# Altium schematic sheet TMS320F28379D_Interfaz.SchDoc
size Legal
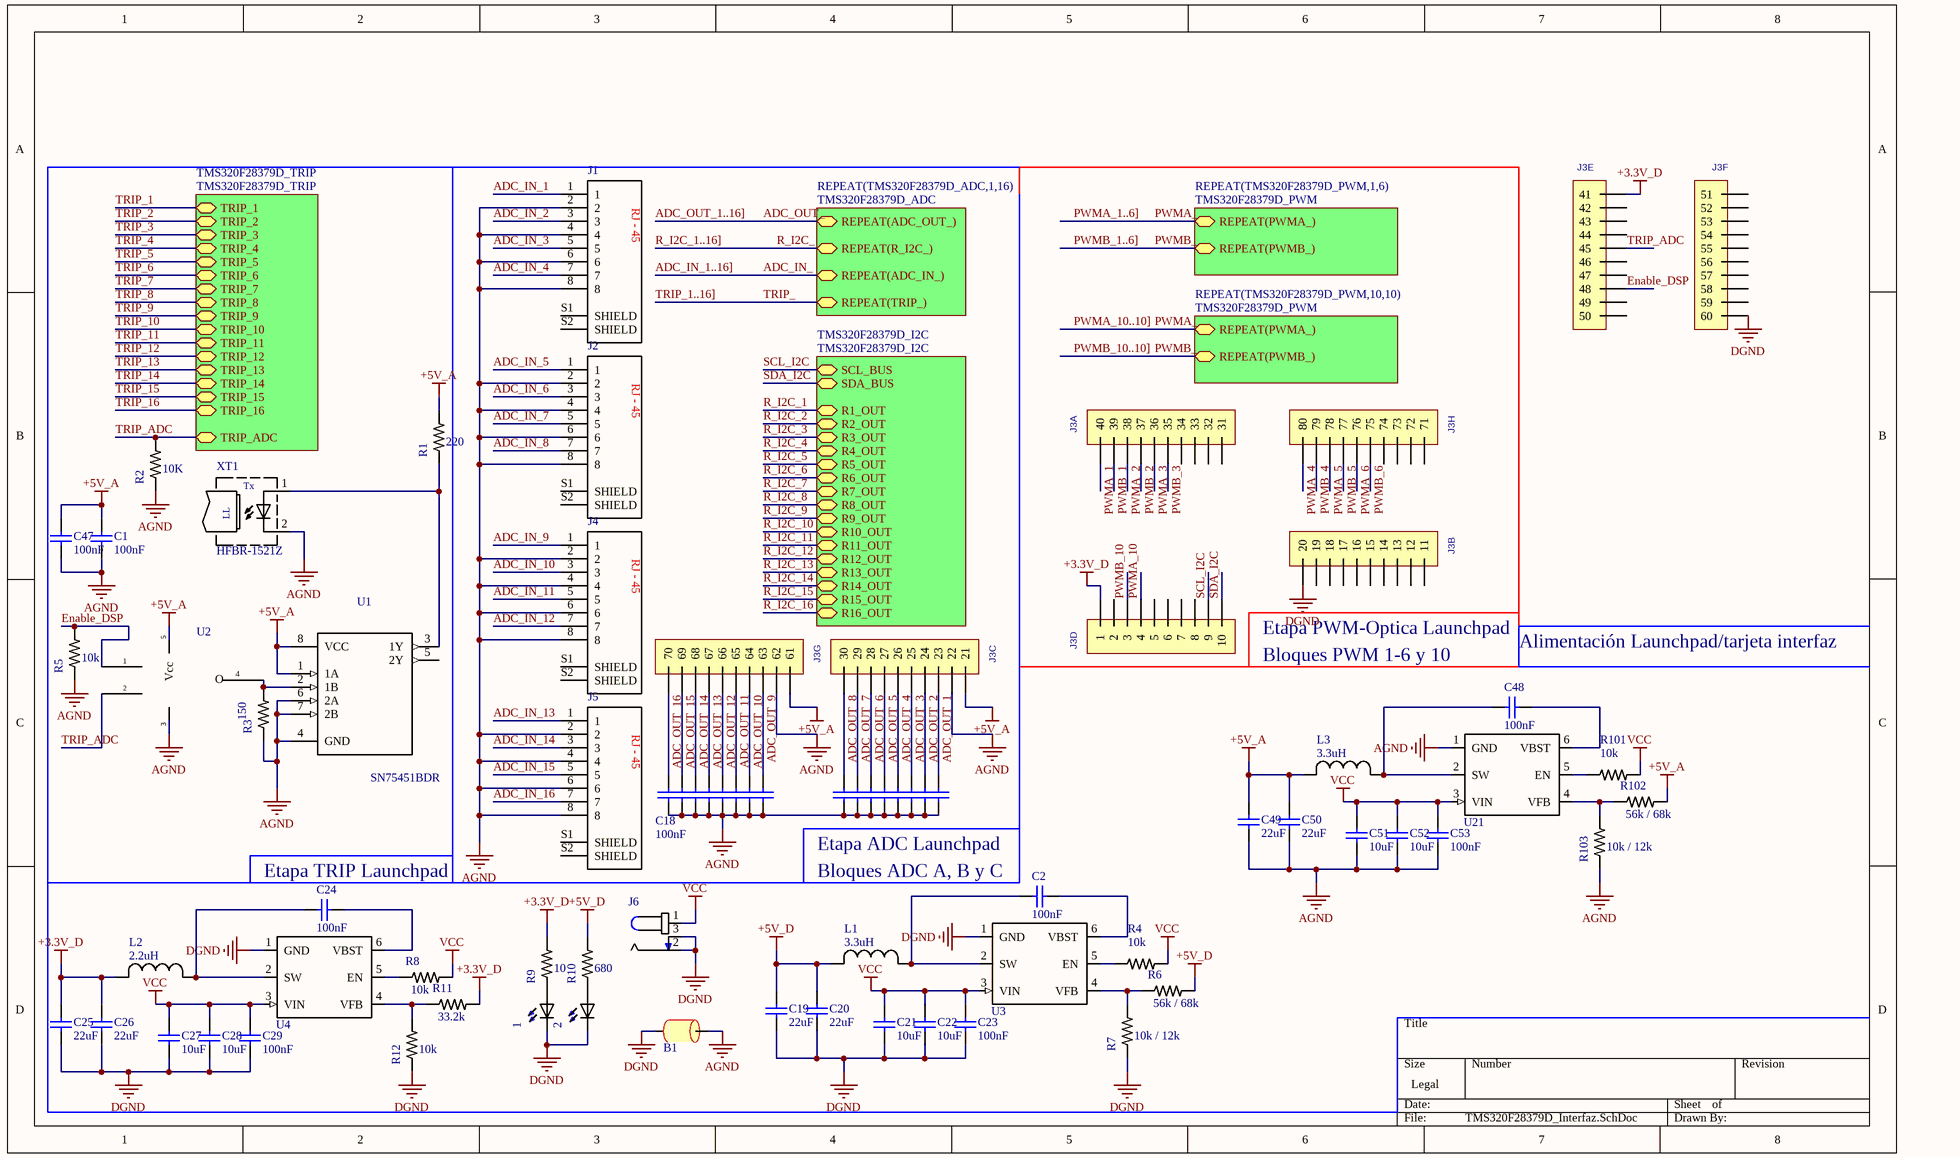
[diagram p0: TMS320F28379D_Interfaz.SchDoc]

## Parts
1  LED  [LED_0805]  (value not drawn)
2  LED  [LED_0805]  (value not drawn)
B1  Bead  [1206]  (value not drawn)
C1  value 100nF  [CAP 0805]  (hidden comment: Cap cerámico)
C2  value 100nF  [CAP 0805]  (hidden comment: Cap cerámico)
C3  Cap cerámico  [CAP 0805]  (value not drawn)
C4  Cap cerámico  [CAP 0805]  (value not drawn)
C5  Cap cerámico  [CAP 0805]  (value not drawn)
C6  Cap cerámico  [CAP 0805]  (value not drawn)
C7  Cap cerámico  [CAP 0805]  (value not drawn)
C8  Cap cerámico  [CAP 0805]  (value not drawn)
C9  Cap cerámico  [CAP 0805]  (value not drawn)
C10  Cap cerámico  [CAP 0805]  (value not drawn)
C11  Cap cerámico  [CAP 0805]  (value not drawn)
C12  Cap cerámico  [CAP 0805]  (value not drawn)
C13  Cap cerámico  [CAP 0805]  (value not drawn)
C14  Cap cerámico  [CAP 0805]  (value not drawn)
C15  Cap cerámico  [CAP 0805]  (value not drawn)
C16  Cap cerámico  [CAP 0805]  (value not drawn)
C17  Cap cerámico  [CAP 0805]  (value not drawn)
C18  value 100nF  [CAP 0805]  (hidden comment: Cap cerámico)
C19  value 22uF  [CAP 1206]  (hidden comment: Cap cerámico)
C20  value 22uF  [CAP 1206]  (hidden comment: Cap cerámico)
C21  value 10uF  [CAP 1206]  (hidden comment: Cap cerámico)
C22  value 10uF  [CAP 1206]  (hidden comment: Cap cerámico)
C23  value 100nF  [CAP 0805]  (hidden comment: Cap cerámico)
C24  value 100nF  [CAP 0805]  (hidden comment: Cap cerámico)
C25  value 22uF  [CAP 1206]  (hidden comment: Cap cerámico)
C26  value 22uF  [CAP 1206]  (hidden comment: Cap cerámico)
C27  value 10uF  [CAP 1206]  (hidden comment: Cap cerámico)
C28  value 10uF  [CAP 1206]  (hidden comment: Cap cerámico)
C29  value 100nF  [CAP 0805]  (hidden comment: Cap cerámico)
C47  value 100nF  [CAP 0805]  (hidden comment: Cap cerámico)
C48  value 100nF  [CAP 0805]  (hidden comment: Cap cerámico)
C49  value 22uF  [CAP 1206]  (hidden comment: Cap cerámico)
C50  value 22uF  [CAP 1206]  (hidden comment: Cap cerámico)
C51  value 10uF  [CAP 1206]  (hidden comment: Cap cerámico)
C52  value 10uF  [CAP 1206]  (hidden comment: Cap cerámico)
C53  value 100nF  [CAP 0805]  (hidden comment: Cap cerámico)
J1  Ethernet TH  [ETHERNET TH]  (value not drawn)
J2  Ethernet TH  [ETHERNET TH]  (value not drawn)
J3  Header 20pin  [Header 20pin_TMS320F28379D]  (value not drawn)  (parts A,B,C,D,E,F,G,H of 8)
J4  Ethernet TH  [ETHERNET TH]  (value not drawn)
J5  Ethernet TH  [ETHERNET TH]  (value not drawn)
J6  694106301002  [Power Jack DC]  (value not drawn)
L1  value 3.3uH  [Inductor 3.3uH]  (hidden comment: Inductor 3.3uH)
L2  value 2.2uH  [Inductor 3.3uH]  (hidden comment: Inductor 2.2uH)
L3  value 3.3uH  [Inductor 3.3uH]  (hidden comment: Inductor 3.3uH)
R1  value 220  [Resistor 0805]  (hidden comment: Resistor 0805)
R2  value 10K  [Resistor 0805]  (hidden comment: Resistor 0805)
R3  value 150  [Resistor 0805]  (hidden comment: Resistor 0805)
R4  value 10k  [Resistor 0805]  (hidden comment: Resistor 0805)
R5  value 10k  [Resistor 0805]  (hidden comment: Resistor 0805)
R6  value 56k / 68k  [Resistor 0805]  (hidden comment: Resistor 0805)
R7  value 10k / 12k  [Resistor 0805]  (hidden comment: Resistor 0805)
R8  value 10k  [Resistor 0805]  (hidden comment: Resistor 0805)
R9  value 10  [Resistor 0805]  (hidden comment: Resistor 0805)
R10  value 680  [Resistor 0805]  (hidden comment: Resistor 0805)
R11  value 33.2k  [Resistor 0805]  (hidden comment: Resistor 0805)
R12  value 10k  [Resistor 0805]  (hidden comment: Resistor 0805)
R101  value 10k  [Resistor 0805]  (hidden comment: Resistor 0805)
R102  value 56k / 68k  [Resistor 0805]  (hidden comment: Resistor 0805)
R103  value 10k / 12k  [Resistor 0805]  (hidden comment: Resistor 0805)
U1  SN75451BDR  [8-SOIC]
U2  NOR MC74VHC1G02DFT2G  [SOT-553]  (value not drawn)
U3  TPS565201DDCR  [6-SOT-23]  (value not drawn)
U4  TPS565201DDCR  [6-SOT-23]  (value not drawn)
U21  TPS565201DDCR  [6-SOT-23]  (value not drawn)
XT1  HFBR-1521Z  [HFBR-15X1Z]

## Sub-sheets
REPEAT(TMS320F28379D_ADC,1,16) = TMS320F28379D_ADC: REPEAT(ADC_OUT_), REPEAT(R_I2C_), REPEAT(ADC_IN_), REPEAT(TRIP_)
REPEAT(TMS320F28379D_PWM,1,6) = TMS320F28379D_PWM: REPEAT(PWMA_), REPEAT(PWMB_)
REPEAT(TMS320F28379D_PWM,10,10) = TMS320F28379D_PWM: REPEAT(PWMA_), REPEAT(PWMB_)
TMS320F28379D_I2C = TMS320F28379D_I2C: SCL_BUS, SDA_BUS, R1_OUT, R2_OUT, R3_OUT, R4_OUT, R5_OUT, R6_OUT, R7_OUT, R8_OUT, R9_OUT, R10_OUT, R11_OUT, R12_OUT, R13_OUT, R14_OUT, R15_OUT, R16_OUT
TMS320F28379D_TRIP = TMS320F28379D_TRIP: TRIP_1, TRIP_2, TRIP_3, TRIP_4, TRIP_5, TRIP_6, TRIP_7, TRIP_8, TRIP_9, TRIP_10, TRIP_11, TRIP_12, TRIP_13, TRIP_14, TRIP_15, TRIP_16, TRIP_ADC

## Nets
+3.3V_D: C25.2 C26.2 J3.1 J3.41 L2.2 R9.2 R11.2
+5V_A: C1.2 C47.2 C49.2 C50.2 J3.21 J3.61 L3.2 R1.2 R102.2 U1.1(1A) U1.8(VCC) U2.5(Vcc)
+5V_D: C19.2 C20.2 L1.2 R6.2 R10.2
AGND: B1.1 C1.1 C3.2 C4.2 C5.2 C6.2 C7.2 C8.2 C9.2 C10.2 C11.2 C12.2 C13.2 C14.2 C15.2 C16.2 C17.2 C18.1 C47.1 C49.1 C50.1 C51.2 C52.2 C53.2 J1.2 J1.4 J1.6 J1.8 J2.2 J2.4 J2.6 J2.8 J3.22 J3.62 J4.2 J4.4 J4.6 J4.8 J5.2 J5.4 J5.6 J5.8 R2.1 R3.1 R5.1 R103.1 U1.4(GND) U1.6(2A) U1.7(2B) U2.3(GND) U21.1(GND) XT1.2(C)
DGND: 1.1(NEG) 2.1(NEG) B1.2 C19.1 C20.1 C21.2 C22.2 C23.2 C25.1 C26.1 C27.2 C28.2 C29.2 J3.20 J3.60 J6.2 J6.3 R7.1 R12.1 U3.1(GND) U4.1(GND)
VCC: C21.1 C22.1 C23.1 C27.1 C28.1 C29.1 C51.1 C52.1 C53.1 J6.1 R4.2 R8.2 R101.2 U3.3(VIN) U4.3(VIN) U21.3(VIN)
ADC_IN_: sheet REPEAT(TMS320F28379D_ADC,1,16)/REPEAT(ADC_IN_)
ADC_IN_1: J1.1
ADC_IN_2: J1.3
ADC_IN_3: J1.5
ADC_IN_4: J1.7
ADC_IN_5: J2.1
ADC_IN_6: J2.3
ADC_IN_7: J2.5
ADC_IN_8: J2.7
ADC_IN_9: J4.1
ADC_IN_10: J4.3
ADC_IN_11: J4.5
ADC_IN_12: J4.7
ADC_IN_13: J5.1
ADC_IN_14: J5.3
ADC_IN_15: J5.5
ADC_IN_16: J5.7
ADC_OUT_: sheet REPEAT(TMS320F28379D_ADC,1,16)/REPEAT(ADC_OUT_)
ADC_OUT_1: C17.1 J3.23
ADC_OUT_2: C16.1 J3.24
ADC_OUT_3: C15.1 J3.25
ADC_OUT_4: C14.1 J3.26
ADC_OUT_5: C13.1 J3.27
ADC_OUT_6: C12.1 J3.28
ADC_OUT_7: C11.1 J3.29
ADC_OUT_8: C10.1 J3.30
ADC_OUT_9: C9.1 J3.63
ADC_OUT_10: C8.1 J3.64
ADC_OUT_11: C7.1 J3.65
ADC_OUT_12: C6.1 J3.66
ADC_OUT_13: C5.1 J3.67
ADC_OUT_14: C4.1 J3.68
ADC_OUT_15: C3.1 J3.69
ADC_OUT_16: C18.2 J3.70
Enable_DSP: J3.48 R5.2 U2.1
PWMA_: sheet REPEAT(TMS320F28379D_PWM,1,6)/REPEAT(PWMA_), sheet REPEAT(TMS320F28379D_PWM,10,10)/REPEAT(PWMA_)
PWMA_1: J3.40
PWMA_2: J3.38
PWMA_3: J3.36
PWMA_4: J3.80
PWMA_5: J3.78
PWMA_6: J3.76
PWMA_10: J3.4
PWMB_: sheet REPEAT(TMS320F28379D_PWM,1,6)/REPEAT(PWMB_), sheet REPEAT(TMS320F28379D_PWM,10,10)/REPEAT(PWMB_)
PWMB_1: J3.39
PWMB_2: J3.37
PWMB_3: J3.35
PWMB_4: J3.79
PWMB_5: J3.77
PWMB_6: J3.75
PWMB_10: J3.3
R_I2C_: sheet REPEAT(TMS320F28379D_ADC,1,16)/REPEAT(R_I2C_)
R_I2C_1: sheet TMS320F28379D_I2C/R1_OUT
R_I2C_2: sheet TMS320F28379D_I2C/R2_OUT
R_I2C_3: sheet TMS320F28379D_I2C/R3_OUT
R_I2C_4: sheet TMS320F28379D_I2C/R4_OUT
R_I2C_5: sheet TMS320F28379D_I2C/R5_OUT
R_I2C_6: sheet TMS320F28379D_I2C/R6_OUT
R_I2C_7: sheet TMS320F28379D_I2C/R7_OUT
R_I2C_8: sheet TMS320F28379D_I2C/R8_OUT
R_I2C_9: sheet TMS320F28379D_I2C/R9_OUT
R_I2C_10: sheet TMS320F28379D_I2C/R10_OUT
R_I2C_11: sheet TMS320F28379D_I2C/R11_OUT
R_I2C_12: sheet TMS320F28379D_I2C/R12_OUT
R_I2C_13: sheet TMS320F28379D_I2C/R13_OUT
R_I2C_14: sheet TMS320F28379D_I2C/R14_OUT
R_I2C_15: sheet TMS320F28379D_I2C/R15_OUT
R_I2C_16: sheet TMS320F28379D_I2C/R16_OUT
SCL_I2C: J3.9 ; sheet TMS320F28379D_I2C/SCL_BUS
SDA_I2C: J3.10 ; sheet TMS320F28379D_I2C/SDA_BUS
TRIP_: sheet REPEAT(TMS320F28379D_ADC,1,16)/REPEAT(TRIP_)
TRIP_1: sheet TMS320F28379D_TRIP/TRIP_1
TRIP_2: sheet TMS320F28379D_TRIP/TRIP_2
TRIP_3: sheet TMS320F28379D_TRIP/TRIP_3
TRIP_4: sheet TMS320F28379D_TRIP/TRIP_4
TRIP_5: sheet TMS320F28379D_TRIP/TRIP_5
TRIP_6: sheet TMS320F28379D_TRIP/TRIP_6
TRIP_7: sheet TMS320F28379D_TRIP/TRIP_7
TRIP_8: sheet TMS320F28379D_TRIP/TRIP_8
TRIP_9: sheet TMS320F28379D_TRIP/TRIP_9
TRIP_10: sheet TMS320F28379D_TRIP/TRIP_10
TRIP_11: sheet TMS320F28379D_TRIP/TRIP_11
TRIP_12: sheet TMS320F28379D_TRIP/TRIP_12
TRIP_13: sheet TMS320F28379D_TRIP/TRIP_13
TRIP_14: sheet TMS320F28379D_TRIP/TRIP_14
TRIP_15: sheet TMS320F28379D_TRIP/TRIP_15
TRIP_16: sheet TMS320F28379D_TRIP/TRIP_16
TRIP_ADC: J3.45 R2.2 U2.2 ; sheet TMS320F28379D_TRIP/TRIP_ADC
Net1_2: 1.2(POS) R9.1
Net2_2: 2.2(POS) R10.1
NetC2_1: C2.1 L1.1 U3.2(SW)
NetC2_2: C2.2 U3.6(VBST)
NetC24_1: C24.1 L2.1 U4.2(SW)
NetC24_2: C24.2 U4.6(VBST)
NetC48_1: C48.1 L3.1 U21.2(SW)
NetC48_2: C48.2 U21.6(VBST)
NetR1_1: R1.1 U1.3(1Y) XT1.1(A)
NetR3_2: R3.2 U1.2(1B) U2.4
NetR4_1: R4.1 U3.5(EN)
NetR6_1: R6.1 R7.2 U3.4(VFB)
NetR8_1: R8.1 U4.5(EN)
NetR11_1: R11.1 R12.2 U4.4(VFB)
NetR101_1: R101.1 U21.5(EN)
NetR102_1: R102.1 R103.2 U21.4(VFB)

Not connected (* = marked no-connect by the designer): J1 S1(SHIELD) S2(SHIELD); J2 S1(SHIELD) S2(SHIELD); J3 2 5 6 7 8 11 12 13 14 15 16 17 18 19 31 32 33 34 42 43 44 46 47 49 50 51 52 53 54 55 56 57 58 59 71 72 73 74; J4 S1(SHIELD) S2(SHIELD); J5 S1(SHIELD) S2(SHIELD); U1 5(2Y)

## Buses and harness runs
bus ADC_IN_1..16]
bus ADC_OUT_1..16]
bus PWMA_1..6]
bus PWMA_10..10]
bus PWMB_1..6]
bus PWMB_10..10]
bus R_I2C_1..16]
bus TRIP_1..16]

## Notes on the sheet
- (near J3) Etapa PWM-Optica Launchpad
- Bloques PWM 1-6 y 10
- Alimentación Launchpad/tarjeta interfaz
- (near C24) Etapa TRIP Launchpad
- Etapa ADC Launchpad
- (near C2) Bloques ADC A, B y C
- (in symbol Ethernet TH) RJ - 45
- (in symbol HFBR-1521Z) Tx; LL
- (in symbol NOR MC74VHC1G02DFT2G) O

## Library data of the parts
1 2 = LED: Manufacturer Part Number: 150080RS75000; Código de producto RS: 815-4225; Digi-Key Part Number: 732-4984-1-ND
B1 = Bead: Ferrite bead; Manufacturer Part Number: BLM31PG500SN1L; Código de producto RS: 724-1589; Digi-Key Part Number: 490-1055-1-ND
C3-C17 = Cap cerámico: Value: 100nF; Digi-Key Part Number: *; Manufacturer Part Number: *
J1 J2 J4 J5 = Ethernet TH: CONN MOD JACK 8P8C VERT SHIELDED; Manufacturer Part Number: 5557969-1; Código de producto RS: 782-7723; Digi-Key Part Number: A31430-ND
J3 = Header 20pin: Manufacturer Part Number: 67996-420HLF; Código de producto RS: 161-2498; Digi-Key Part Number: 609-3221-ND
J6 = Power Jack: Connector, Power Entry, Jack, 3a, 20vdc; Código de producto RS: 122-4879; Digi-Key Part Number: 732-5930-ND; Manufacturer Part Number: 694106301002
L1 L3 = Inductor 3.3uH: Inductor; Manufacturer Part Number: 744311330; Código de producto RS: 736-1949; Digi-Key Part Number: 732-1152-1-ND
L2 = Inductor 2.2uH: Inductor; Manufacturer Part Number: 744311220; Código de producto RS: 736-1945; Digi-Key Part Number: 732-1151-1-ND
R1-R12 R101-R103 = Resistor: Digi-Key Part Number: *; Manufacturer Part Number: *
U1 = SN75451BDR: Dual Very-High Speed, High-Current Peripheral Drivers 8-SOIC 0 to 70; Código de producto RS: 662-4015; Manufacturer Part Number: SN75451BDR; Digi-Key Part Number: 296-14960-6-ND
U2 = NOR MC74VHC1G02DFT2G: NOR Gate IC 1 Channel SC-88A (SC-70-5/SOT-353); Código de producto RS: 806-3945; Digi-Key Part Number: MC74VHC1G02DFT2GOSCT-ND; Manufacturer Part Number: MC74VHC1G02DFT2G
U3 U4 U21 = TPS565201DDCR: Buck 5A; Manufacturer Part Number: TPS565201DDCR; Digi-Key Part Number: 296-49006-1-ND
XT1 = HFBR-1521Z: Código de producto RS: 171-1600; Digi-Key Part Number: 516-2043-ND; Manufacturer Part Number: HFBR-1521Z
C1 C2 C18-C29 C47-C53 = Cap cerámico: Digi-Key Part Number: *; Manufacturer Part Number: *